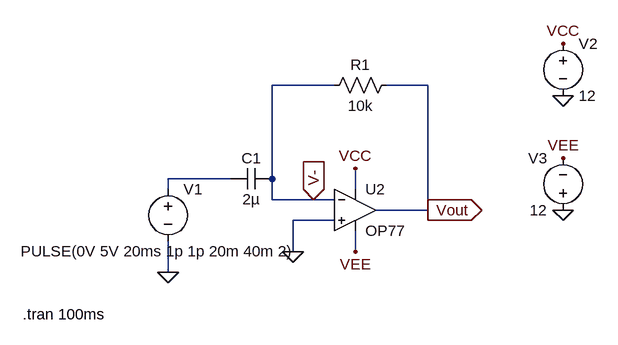
[diagram p0: schematic Differentiator_a.asc]
Differentiator_a.asc, the LTspice schematic file:
Version 4
SHEET 1 880 680
WIRE 176 32 80 32
WIRE 320 32 256 32
WIRE 16 176 -80 176
WIRE 80 176 80 32
WIRE -80 192 -80 176
WIRE 208 192 208 160
WIRE 80 208 80 176
WIRE 144 208 80 208
WIRE 176 208 144 208
WIRE 320 224 320 32
WIRE 320 224 240 224
WIRE 176 240 112 240
WIRE 112 288 112 240
WIRE 208 288 208 256
WIRE -80 320 -80 272
FLAG 112 288 0
FLAG 208 160 VCC
FLAG 208 288 VEE
FLAG -80 320 0
FLAG 320 224 Vout
IOPIN 320 224 Out
FLAG 144 208 V-
IOPIN 144 208 In
FLAG 528 48 0
FLAG 528 224 0
FLAG 528 -32 VCC
FLAG 528 144 VEE
SYMBOL res 272 16 R90
WINDOW 0 0 56 VBottom 2
WINDOW 3 32 56 VTop 2
SYMATTR InstName R1
SYMATTR Value 10k
SYMBOL cap 80 160 R90
WINDOW 0 0 32 VBottom 2
WINDOW 3 32 32 VTop 2
SYMATTR InstName C1
SYMATTR Value 2µ
SYMBOL voltage -80 176 R0
WINDOW 3 -227 111 Left 2
WINDOW 123 0 0 Left 0
WINDOW 39 0 0 Left 0
SYMATTR InstName V1
SYMATTR Value PULSE(0V 5V 20ms 1p 1p 20m 40m 2)
SYMBOL voltage 528 -48 R0
WINDOW 123 0 0 Left 0
WINDOW 39 0 0 Left 0
SYMATTR InstName V2
SYMATTR Value 12
SYMBOL voltage 528 240 R180
WINDOW 0 24 96 Left 2
WINDOW 3 24 16 Left 2
WINDOW 123 0 0 Left 0
WINDOW 39 0 0 Left 0
SYMATTR InstName V3
SYMATTR Value 12
SYMBOL OpAmps\\OP77 208 160 R0
SYMATTR InstName U2
TEXT -304 384 Left 2 !.tran 100ms

The netlist it stands for:
* Differentiator_a.asc
R1 Vout V- 10k
C1 V- N001 2µ
V1 N001 0 PULSE(0V 5V 20ms 1p 1p 20m 40m 2)
V2 VCC 0 12
V3 0 VEE 12
XU2 0 V- VCC VEE Vout OP77  ; pins In+ In- V+ V- OUT
.tran 100ms
.lib ADI.lib
.backanno
.end